# Altium project PreCharge.PrjPcb (part 1 of 2)
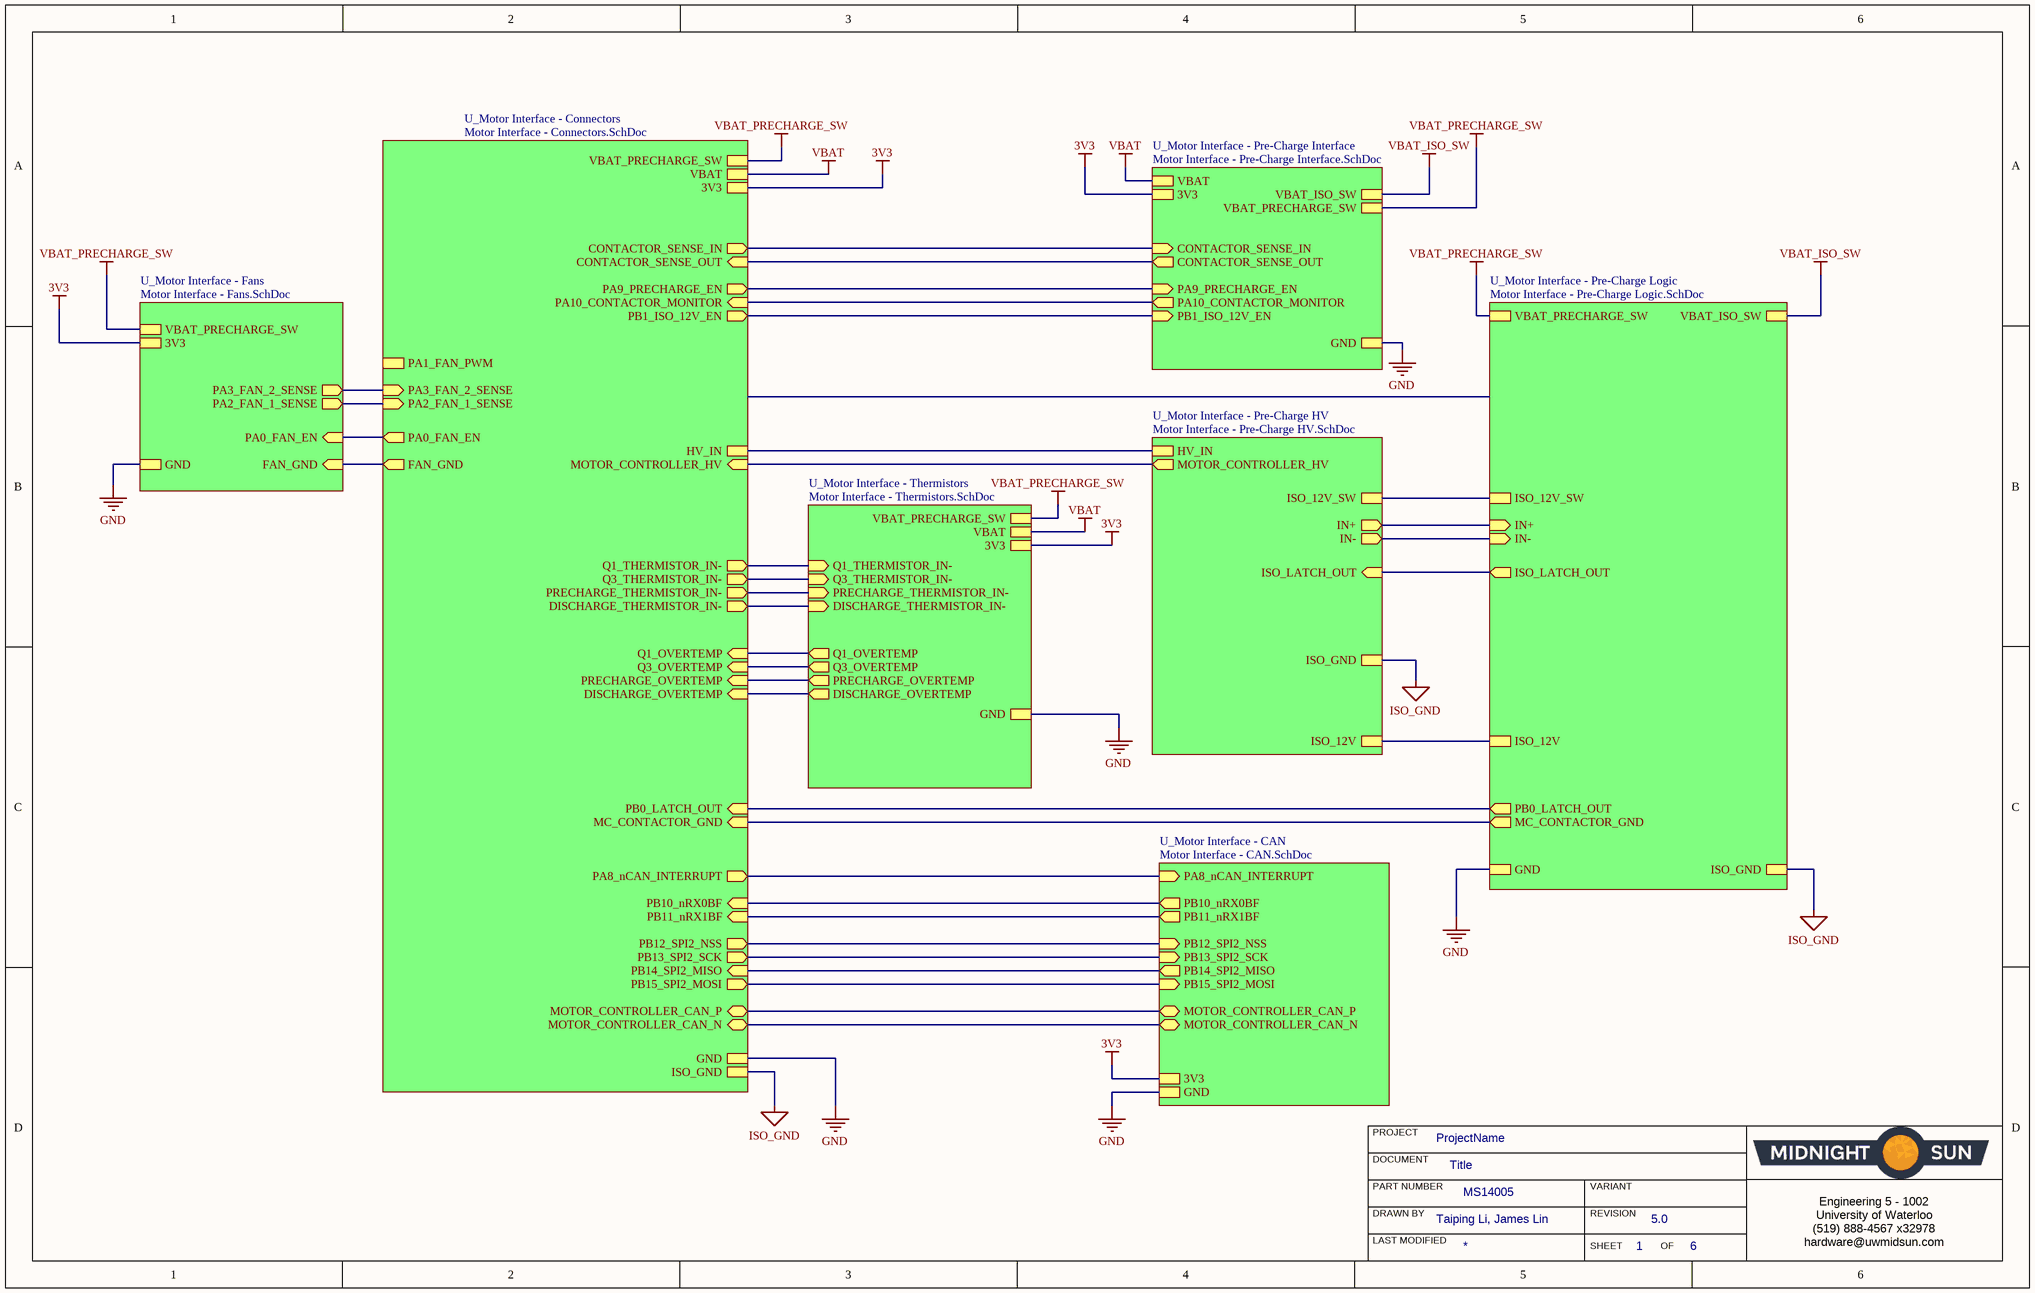
[diagram p0: Motor Interface - Top Sheet.SchDoc]
MSPartNumber: MS14005; ProjectAuthor: Taiping Li, James Lin; ProjectRevision: 5.0
5 sheets, 69 parts. Net scope: strictly hierarchical (ports join the sheet entries above them; power ports are local).
Board file: Motor Interface.PcbDoc
Sheets:
  Motor Interface - Top Sheet.SchDoc
    U_Motor Interface - CAN = Motor Interface - CAN.SchDoc
    U_Motor Interface - Pre-Charge Interface = Motor Interface - Pre-Charge Interface.SchDoc
    U_Motor Interface - Connectors = Motor Interface - Connectors.SchDoc
    U_Motor Interface - Thermistors = Motor Interface - Thermistors.SchDoc

## Sheet Motor Interface - Top Sheet.SchDoc: Title
size B; Organization: Midnight Sun Solar Rayce Car Team; Address1: University of Waterloo; Address2: 200 University Ave W; Address3: Waterloo, ON, Canada; Address4: N2L 3E9; DocumentNumber: 1; SheetNumber: 1; SheetTotal: 6; Website: www.uwmidsun.com; ProjectName: ProjectName

### Sub-sheets
U_Motor Interface - CAN = Motor Interface - CAN.SchDoc: PB12_SPI2_NSS (in), PB14_SPI2_MISO (out), PB15_SPI2_MOSI (in), PB13_SPI2_SCK (in), PA8_nCAN_INTERRUPT (in), MOTOR_CONTROLLER_CAN_P (bidir), MOTOR_CONTROLLER_CAN_N (bidir), PB10_nRX0BF (out), PB11_nRX1BF (out), 3V3, GND
U_Motor Interface - Connectors = Motor Interface - Connectors.SchDoc: MOTOR_CONTROLLER_HV (in), MOTOR_CONTROLLER_CAN_P (bidir), MOTOR_CONTROLLER_CAN_N (bidir), CONTACTOR_SENSE_IN (out), CONTACTOR_SENSE_OUT (in), PB10_nRX0BF (in), PB11_nRX1BF (in), PA10_CONTACTOR_MONITOR (in), PB12_SPI2_NSS (out), PB15_SPI2_MOSI (out), HV_IN, ISO_GND, PA9_PRECHARGE_EN (out), PB13_SPI2_SCK (out), VBAT, PA8_nCAN_INTERRUPT (out), PB14_SPI2_MISO (in), 3V3, GND, VBAT_PRECHARGE_SW, PB0_LATCH_OUT (in), FAN_GND (out), PA0_FAN_EN (out), PA2_FAN_1_SENSE (in), PA3_FAN_2_SENSE (in), Q1_THERMISTOR_IN- (out), Q3_THERMISTOR_IN- (out), PRECHARGE_THERMISTOR_IN- (out), DISCHARGE_THERMISTOR_IN- (out), Q1_OVERTEMP (in), Q3_OVERTEMP (in), PRECHARGE_OVERTEMP (in), DISCHARGE_OVERTEMP (in), MC_CONTACTOR_GND (in), PB1_ISO_12V_EN (out), PA1_FAN_PWM
U_Motor Interface - Fans = Motor Interface - Fans.SchDoc (file not in this document): GND, FAN_GND (in), PA0_FAN_EN (in), PA2_FAN_1_SENSE (out), PA3_FAN_2_SENSE (out), VBAT_PRECHARGE_SW, 3V3
U_Motor Interface - Pre-Charge HV = Motor Interface - Pre-Charge HV.SchDoc (file not in this document): MOTOR_CONTROLLER_HV (out), IN- (out), IN+ (out), ISO_LATCH_OUT (in), ISO_12V_SW, HV_IN, ISO_GND, ISO_12V
U_Motor Interface - Pre-Charge Interface = Motor Interface - Pre-Charge Interface.SchDoc: CONTACTOR_SENSE_IN (in), CONTACTOR_SENSE_OUT (out), PA9_PRECHARGE_EN (in), GND, PA10_CONTACTOR_MONITOR (out), 3V3, VBAT, VBAT_PRECHARGE_SW, VBAT_ISO_SW, PB1_ISO_12V_EN (in)
U_Motor Interface - Pre-Charge Logic = Motor Interface - Pre-Charge Logic.SchDoc (file not in this document): ISO_LATCH_OUT (out), GND, ISO_GND, ISO_12V_SW, IN- (in), IN+ (in), VBAT_PRECHARGE_SW, PB0_LATCH_OUT (out), ISO_12V, MC_CONTACTOR_GND (out), VBAT_ISO_SW
U_Motor Interface - Thermistors = Motor Interface - Thermistors.SchDoc: Q1_THERMISTOR_IN- (in), Q3_THERMISTOR_IN- (in), PRECHARGE_THERMISTOR_IN- (in), DISCHARGE_THERMISTOR_IN- (in), Q1_OVERTEMP (out), Q3_OVERTEMP (out), PRECHARGE_OVERTEMP (out), DISCHARGE_OVERTEMP (out), GND, 3V3, VBAT, VBAT_PRECHARGE_SW

### Nets
3V3: sheet U_Motor Interface - CAN/3V3, sheet U_Motor Interface - Pre-Charge Interface/CONTACTOR_SENSE_OUT, sheet U_Motor Interface - Pre-Charge Interface/3V3, sheet U_Motor Interface - Connectors/CONTACTOR_SENSE_OUT, sheet U_Motor Interface - Connectors/3V3, sheet U_Motor Interface - Fans/3V3, sheet U_Motor Interface - Thermistors/3V3
GND: sheet U_Motor Interface - CAN/GND, sheet U_Motor Interface - Pre-Charge Interface/GND, sheet U_Motor Interface - Connectors/GND, sheet U_Motor Interface - Pre-Charge Logic/GND, sheet U_Motor Interface - Fans/GND, sheet U_Motor Interface - Thermistors/GND
HV_IN: sheet U_Motor Interface - Pre-Charge HV/HV_IN, sheet U_Motor Interface - Connectors/HV_IN
ISO_GND: sheet U_Motor Interface - Pre-Charge HV/ISO_GND, sheet U_Motor Interface - Connectors/ISO_GND, sheet U_Motor Interface - Pre-Charge Logic/ISO_GND
VBAT: sheet U_Motor Interface - Pre-Charge Interface/VBAT, sheet U_Motor Interface - Connectors/VBAT, sheet U_Motor Interface - Thermistors/VBAT
VBAT_ISO_SW: sheet U_Motor Interface - Pre-Charge Interface/VBAT_ISO_SW, sheet U_Motor Interface - Pre-Charge Logic/VBAT_ISO_SW
VBAT_PRECHARGE_SW: sheet U_Motor Interface - Pre-Charge Interface/VBAT_PRECHARGE_SW, sheet U_Motor Interface - Connectors/VBAT_PRECHARGE_SW, sheet U_Motor Interface - Pre-Charge Logic/VBAT_PRECHARGE_SW, sheet U_Motor Interface - Fans/VBAT_PRECHARGE_SW, sheet U_Motor Interface - Thermistors/VBAT_PRECHARGE_SW
CONTACTOR_SENSE_IN: sheet U_Motor Interface - Pre-Charge Interface/CONTACTOR_SENSE_IN, sheet U_Motor Interface - Connectors/CONTACTOR_SENSE_IN
DISCHARGE_OVERTEMP: sheet U_Motor Interface - Connectors/DISCHARGE_OVERTEMP, sheet U_Motor Interface - Thermistors/DISCHARGE_OVERTEMP
DISCHARGE_THERMISTOR_IN-: sheet U_Motor Interface - Connectors/DISCHARGE_THERMISTOR_IN-, sheet U_Motor Interface - Thermistors/DISCHARGE_THERMISTOR_IN-
FAN_GND: sheet U_Motor Interface - Connectors/FAN_GND, sheet U_Motor Interface - Fans/FAN_GND
MOTOR_CONTROLLER_CAN_N: sheet U_Motor Interface - CAN/MOTOR_CONTROLLER_CAN_N, sheet U_Motor Interface - Connectors/MOTOR_CONTROLLER_CAN_N
MOTOR_CONTROLLER_CAN_P: sheet U_Motor Interface - CAN/MOTOR_CONTROLLER_CAN_P, sheet U_Motor Interface - Connectors/MOTOR_CONTROLLER_CAN_P
MOTOR_CONTROLLER_HV: sheet U_Motor Interface - Pre-Charge HV/MOTOR_CONTROLLER_HV, sheet U_Motor Interface - Connectors/MOTOR_CONTROLLER_HV
PA0/AN0: sheet U_Motor Interface - Connectors/PA0_FAN_EN, sheet U_Motor Interface - Fans/PA0_FAN_EN
PA2: sheet U_Motor Interface - Connectors/PA2_FAN_1_SENSE, sheet U_Motor Interface - Fans/PA2_FAN_1_SENSE
PA3: sheet U_Motor Interface - Connectors/PA3_FAN_2_SENSE, sheet U_Motor Interface - Fans/PA3_FAN_2_SENSE
PA8_nCAN_INTERRUPT: sheet U_Motor Interface - CAN/PA8_nCAN_INTERRUPT, sheet U_Motor Interface - Connectors/PA8_nCAN_INTERRUPT
PA9_PRECHARGE_EN: sheet U_Motor Interface - Pre-Charge Interface/PA9_PRECHARGE_EN, sheet U_Motor Interface - Connectors/PA9_PRECHARGE_EN
PA10_CONTACTOR_MONITOR: sheet U_Motor Interface - Pre-Charge Interface/PA10_CONTACTOR_MONITOR, sheet U_Motor Interface - Connectors/PA10_CONTACTOR_MONITOR
PB0: sheet U_Motor Interface - Connectors/PB0_LATCH_OUT, sheet U_Motor Interface - Pre-Charge Logic/PB0_LATCH_OUT
PB1_ISO_12V_EN: sheet U_Motor Interface - Pre-Charge Interface/PB1_ISO_12V_EN, sheet U_Motor Interface - Connectors/PB1_ISO_12V_EN
PB10_nRX0BF: sheet U_Motor Interface - CAN/PB10_nRX0BF, sheet U_Motor Interface - Connectors/PB10_nRX0BF
PB11_nRX1BF: sheet U_Motor Interface - CAN/PB11_nRX1BF, sheet U_Motor Interface - Connectors/PB11_nRX1BF
PB12_SPI2_NSS: sheet U_Motor Interface - CAN/PB12_SPI2_NSS, sheet U_Motor Interface - Connectors/PB12_SPI2_NSS
PB13_SPI2_SCK: sheet U_Motor Interface - CAN/PB13_SPI2_SCK, sheet U_Motor Interface - Connectors/PB13_SPI2_SCK
PB14_SPI2_MISO: sheet U_Motor Interface - CAN/PB14_SPI2_MISO, sheet U_Motor Interface - Connectors/PB14_SPI2_MISO
PB15_SPI2_MOSI: sheet U_Motor Interface - CAN/PB15_SPI2_MOSI, sheet U_Motor Interface - Connectors/PB15_SPI2_MOSI
PRECHARGE_OVERTEMP: sheet U_Motor Interface - Connectors/PRECHARGE_OVERTEMP, sheet U_Motor Interface - Thermistors/PRECHARGE_OVERTEMP
PRECHARGE_THERMISTOR_IN-: sheet U_Motor Interface - Connectors/PRECHARGE_THERMISTOR_IN-, sheet U_Motor Interface - Thermistors/PRECHARGE_THERMISTOR_IN-
Q1_OVERTEMP: sheet U_Motor Interface - Connectors/Q1_OVERTEMP, sheet U_Motor Interface - Thermistors/Q1_OVERTEMP
Q1_THERMISTOR_IN-: sheet U_Motor Interface - Connectors/Q1_THERMISTOR_IN-, sheet U_Motor Interface - Thermistors/Q1_THERMISTOR_IN-
Q3_OVERTEMP: sheet U_Motor Interface - Connectors/Q3_OVERTEMP, sheet U_Motor Interface - Thermistors/Q3_OVERTEMP
Q3_THERMISTOR_IN-: sheet U_Motor Interface - Connectors/Q3_THERMISTOR_IN-, sheet U_Motor Interface - Thermistors/Q3_THERMISTOR_IN-
(unnamed): sheet U_Motor Interface - Pre-Charge HV/IN-, sheet U_Motor Interface - Pre-Charge Logic/IN-
(unnamed): sheet U_Motor Interface - Pre-Charge HV/IN+, sheet U_Motor Interface - Pre-Charge Logic/IN+
(unnamed): sheet U_Motor Interface - Pre-Charge HV/ISO_LATCH_OUT, sheet U_Motor Interface - Pre-Charge Logic/ISO_LATCH_OUT
(unnamed): sheet U_Motor Interface - Pre-Charge HV/ISO_12V_SW, sheet U_Motor Interface - Pre-Charge Logic/ISO_12V_SW
(unnamed): sheet U_Motor Interface - Pre-Charge HV/ISO_12V, sheet U_Motor Interface - Pre-Charge Logic/ISO_12V
(unnamed): sheet U_Motor Interface - Connectors/MC_CONTACTOR_GND, sheet U_Motor Interface - Pre-Charge Logic/MC_CONTACTOR_GND

### Notes on the sheet
- PROJECT
- DOCUMENT
- DRAWN BY
- LAST MODIFIED
- PART NUMBER
- REVISION
- SHEET
- VARIANT
- OF
- Engineering 5 - 1002
  University of Waterloo
  (519) 888-4567 x32978
  hardware@uwmidsun.com

## Sheet Motor Interface - CAN.SchDoc: Motor Interface - CAN
size B; PageSetup: Record=PageOptions|CenterHorizontal=True|CenterVertical=True|PrintScale=0.64|XCorrection=1.00|YCorrection=1.00|PrintKind=1|BorderSize=5000000|LeftOffset=0|BottomOffset=0|Orientation=2|PaperLength=1000|PaperWidth=1000|Scale=100|PaperSource=7|PrintQuality=-3|MediaType=1|DitherType=10|PrintScaleMode=1|PaperKind=Letter|PaperIndex=1; Organization: Midnight Sun Solar Rayce Car Team; Address1: University of Waterloo; Address2: 200 University Ave W; Address3: Waterloo, ON, Canada; Address4: N2L 3E9; DocumentNumber: 3; SheetNumber: 3; SheetTotal: 6; Website: www.uwmidsun.com; ProjectName: ProjectName
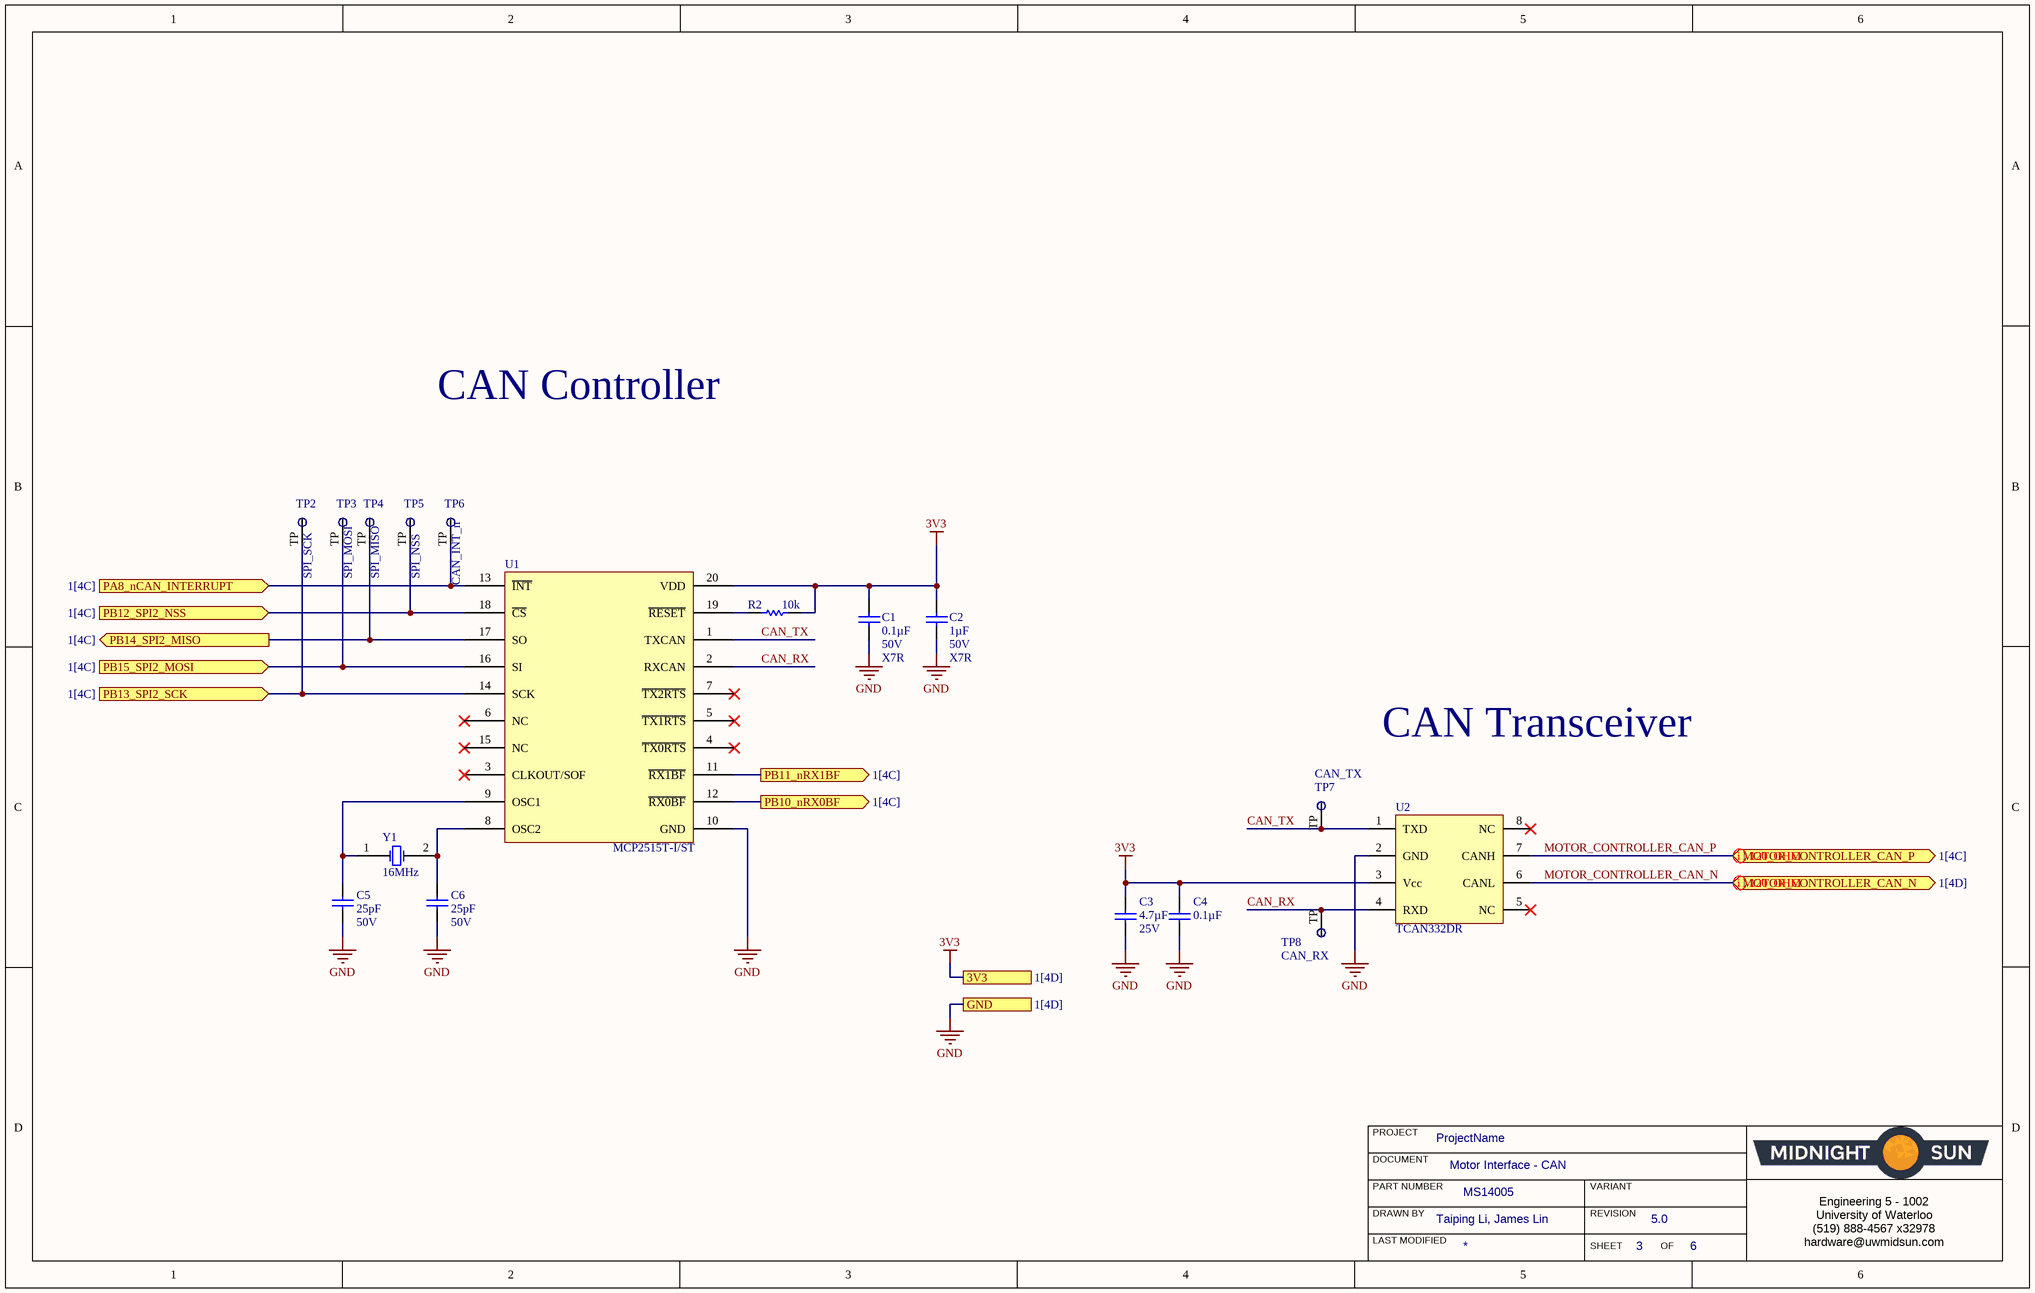
[diagram p1: Motor Interface - CAN.SchDoc]

### Parts
C1  Capacitance: 0.1µF  Voltage: 50V  Temperature Coefficient: X7R  [CAP, 0603]  (hidden comment: CAP CER 0.1UF 50V 10% X7R 0603)
C2  Capacitance: 1µF  Voltage: 50V  Temperature Coefficient: X7R  [CAP, 0603]  (hidden comment: CAP CER 1UF 50V 10% X7R 0603)
C3  Voltage: 25V  Capacitance: 4.7µF  [CAP, 0603]  (hidden comment: CAP CER 4.7UF 25V 10% X5R 0603)
C4  Capacitance: 0.1µF  [CAP, 0603]  (hidden comment: CAP CER 0.1UF 50V 10% X7R 0603)
C5  Voltage - Rated: 50V  Capacitance: 25pF  [CAP, 0603]  (hidden comment: CAP CER 25PF 50V ±5% C0G/NP0 0603)
C6  Voltage - Rated: 50V  Capacitance: 25pF  [CAP, 0603]  (hidden comment: CAP CER 25PF 50V ±5% C0G/NP0 0603)
R2  Resistance: 10k  [RES, 0603]  (hidden comment: RES 10K OHM 1% 1/10W 0603)
TP2  SPI_SCK  [Test Point]  (no BOM)
TP3  SPI_MOSI  [Test Point]  (no BOM)
TP4  SPI_MISO  [Test Point]  (no BOM)
TP5  SPI_NSS  [Test Point]  (no BOM)
TP6  CAN_INT_n  [Test Point]  (no BOM)
TP7  CAN_TX  [Test Point]  (no BOM)
TP8  CAN_RX  [Test Point]  (no BOM)
U1  Manufacturer Part Number: MCP2515T-I/ST  [TSSOP65P640X120-20N]  (hidden comment: MCP2515)
U2  Manufacturer Part Number: TCAN332DR  [TSOP65P280X145-8N]  (hidden comment: IC CAN Tranceiver TCAN332DR)
Y1  Frequency: 16MHz  [ABM3 CRYSTAL]  (hidden comment: CRYSTAL 16 MHz 18PF 2-SMD)

### Ports
3V3 (see 1[4D]), GND (see 1[4D]), MOTOR_CONTROLLER_CAN_N (bidir, see 1[4D]), MOTOR_CONTROLLER_CAN_P (bidir, see 1[4C]), PA8_nCAN_INTERRUPT (in, see 1[4C]), PB10_nRX0BF (out, see 1[4C]), PB11_nRX1BF (out, see 1[4C]), PB12_SPI2_NSS (in, see 1[4C]), PB13_SPI2_SCK (in, see 1[4C]), PB14_SPI2_MISO (out, see 1[4C]), PB15_SPI2_MOSI (in, see 1[4C])

### Nets
3V3: C1.1 C2.1 C3.2 C4.2 R2.2 U1.20(VDD) U2.3(Vcc) ; port 3V3
GND: C1.2 C2.2 C3.1 C4.1 C5.2 C6.2 U1.10(GND) U2.2(GND) ; port GND
CAN_RX: TP8.TP U1.2(RXCAN) U2.4(RXD)
CAN_TX: TP7.TP U1.1(TXCAN) U2.1(TXD)
MOTOR_CONTROLLER_CAN_N: U2.6(CANL) ; port MOTOR_CONTROLLER_CAN_N
MOTOR_CONTROLLER_CAN_P: U2.7(CANH) ; port MOTOR_CONTROLLER_CAN_P
PA8_nCAN_INTERRUPT: TP6.TP U1.13(~{INT}) ; port PA8_nCAN_INTERRUPT
PB10_nRX0BF: U1.12(~{RX0BF}) ; port PB10_nRX0BF
PB11_nRX1BF: U1.11(~{RX1BF}) ; port PB11_nRX1BF
PB12_SPI2_NSS: TP5.TP U1.18(~{CS}) ; port PB12_SPI2_NSS
PB13_SPI2_SCK: TP2.TP U1.14(SCK) ; port PB13_SPI2_SCK
PB14_SPI2_MISO: TP4.TP U1.17(SO) ; port PB14_SPI2_MISO
PB15_SPI2_MOSI: TP3.TP U1.16(SI) ; port PB15_SPI2_MOSI
NetC5_1: C5.1 U1.9(OSC1) Y1.1
NetC6_1: C6.1 U1.8(OSC2) Y1.2
NetR2_1: R2.1 U1.19(~{RE}~{SET})

Not connected (* = marked no-connect by the designer): U1 3(CLKOUT/SOF)* 4(~{TX0RTS})* 5(~{TX1RTS})* 6(NC)* 7(~{TX2RTS})* 15(NC)*; U2 5(NC)* 8(NC)*

### Layout directives
differential pair: MOTOR_CONTROLLER_CAN_N, MOTOR_CONTROLLER_CAN_P

### Notes on the sheet
- CAN Controller
- CAN Transceiver
- PROJECT
- DOCUMENT
- DRAWN BY
- LAST MODIFIED
- PART NUMBER
- REVISION
- SHEET
- VARIANT
- OF
- Engineering 5 - 1002
  University of Waterloo
  (519) 888-4567 x32978
  hardware@uwmidsun.com

### Library data of the parts
C1 C4 = CAP CER 0.1UF 50V 10% X7R 0603: 0.10µF ±10% 50V Ceramic Capacitor X7R 0603 (1608 Metric); Manufacturer 1: AVX Corporation; Manufacturer Part Number 1: 06035C104KAT2A; Supplier 1: Digi-Key; Supplier Part Number 1: 478-5052-1-ND; Packaging: Cut Tape (CT); Part Status: Active; Operating Temperature: -55°C ~ 125°C; Ratings: -; Mounting Type: Surface Mount, MLCC; Package / Case: 0603 (1608 Metric); Size / Dimension: 0.063" L x 0.032" W (1.60mm x 0.81mm); Height - Seated (Max): -; Thickness (Max): 0.035" (0.90mm); Lead Spacing: -; Lead Style: -; ComponentLink1URL: http://datasheets.avx.com/X7RDielectric.pdf; ComponentLink1Description: http://datasheets.avx.com/X7RDielectric.pdf; Tolerance: ±10%
  C4: Voltage: 50V; Temperature Coefficient: X7R
C2 = CAP CER 1UF 50V 10% X7R 0603: 1µF ±10% 50V Ceramic Capacitor X7R 0603 (1608 Metric); Manufacturer 1: Taiyo Yuden; Manufacturer Part Number 1: UMK107AB7105KA-T; Supplier 1: Digi-Key; Supplier Part Number 1: 587-3247-1-ND; Packaging: Cut Tape (CT); Part Status: Active; Operating Temperature: -55°C ~ 125°C; Ratings: -; Mounting Type: Surface Mount, MLCC; Package / Case: 0603 (1608 Metric); Size / Dimension: 0.063" L x 0.031" W (1.60mm x 0.80mm); Height - Seated (Max): -; Thickness (Max): 0.037" (0.95mm); Lead Spacing: -; Lead Style: -; ComponentLink1URL: http://www.yuden.co.jp/productdata/catalog/en/mlcc_all_e.pdf; ComponentLink1Description: http://www.yuden.co.jp/productdata/catalog/en/mlcc_all_e.pdf; Tolerance: ±10%
C3 = CAP CER 4.7UF 25V 10% X5R 0603: 4.7µF ±10% 25V Ceramic Capacitor X5R 0603 (1608 Metric); Manufacturer 1: Murata Electronics North America; Manufacturer Part Number 1: GRM188R61E475KE11D; Supplier 1: Digi-Key; Supplier Part Number 1: 490-7203-1-ND; Packaging: Cut Tape (CT); Part Status: Active; Operating Temperature: -55°C ~ 85°C; Ratings: -; Mounting Type: Surface Mount, MLCC; Package / Case: 0603 (1608 Metric); Size / Dimension: 0.063" L x 0.031" W (1.60mm x 0.80mm); Height - Seated (Max): -; Thickness (Max): 0.031" (0.80mm); Lead Spacing: -; Lead Style: -; ComponentLink1URL: http://www.murata.com/~/media/webrenewal/support/library/catalog/products/capacitor/mlcc/c02e.ashx; ComponentLink1Description: http://www.murata.com/~/media/webrenewal/support/library/catalog/products/capacitor/mlcc/c02e.ashx; Tolerance: ±10%; Temperature Coefficient: X5R
C5 C6 = CAP CER 25PF 50V ±5% C0G/NP0 0603: 25pF 50V Ceramic Capacitor C0G, NP0 0603 (1608 Metric) 0.063" L x 0.032" W (1.60mm x 0.80mm); Manufacturer: Samsung Electro-Mechanics; Manufacturer Part Number: CL10C250JB8NNNC; Notification: Current market demand for these product types have resulted in fluctuating and extending lead times. Lead times may differ.; Supplier 1: Digi-Key; RoHS: RoHS Compliant; Category: Capacitors; Stock 1: 36668; Pricing 1: 1=0.14, 10=0.061, 100=0.0274, 500=0.01962, 1000=0.01542 (CAD); Packaging: Cut Tape (CT); Part Status: Active; Tolerance: ±5%; Operating Temperature: -55°C ~ 125°C; Features: -; Ratings: -; Applications: General Purpose; Mounting Type: Surface Mount, MLCC; Package / Case: 0603 (1608 Metric); Size / Dimension: 0.063" L x 0.032" W (1.60mm x 0.80mm); Height - Seated (Max): -; Thickness (Max): 0.035" (0.90mm); Lead Spacing: -; Lead Style: -; ComponentLink1URL: http://www.samsungsem.com/kr/support/product-search/mlcc/CL10C250JB8NNNC.jsp; ComponentLink1Description: http://www.samsungsem.com/kr/support/product-search/mlcc/CL10C250JB8NNNC.jsp; Supplier Part Number 1: 1276-2244-1-ND; Temperature Coefficient: C0G, NP0
R2 = RES 10K OHM 1% 1/10W 0603: RES SMD 10K OHM 1% 1/10W 0603; Manufacturer 1: Yageo; Manufacturer Part Number 1: RC0603FR-0710KL; Temperature Coefficient: ±100ppm/°C; Supplier 1: Digi-Key; Supplier Part Number 1: 311-10.0KHRCT-ND; Packaging: Cut Tape (CT); Part Status: Active; Composition: Thick Film; Operating Temperature: -55°C ~ 155°C; Package / Case: 0603 (1608 Metric); Supplier Device Package: 0603; Size / Dimension: 0.063" L x 0.031" W (1.60mm x 0.80mm); Height - Seated (Max): 0.022" (0.55mm); Failure Rate: -; ComponentLink1URL: http://www.yageo.com/documents/recent/PYu-RC_Group_51_RoHS_L_7.pdf; ComponentLink1Description: http://www.yageo.com/documents/recent/PYu-RC_Group_51_RoHS_L_7.pdf; Tolerance: ±1%; Power: 1/10W
TP2-TP8 = Test Point
U1 = IC CAN SPI CONTROLLER MCP2515T-I/ST 20-TSSOP: CAN Controller CAN 2.0 SPI Interface 20-TSSOP; Manufacturer: Microchip Technology; Standards: CAN 2.0; Voltage - Supply: 2.7 V ~ 5.5 V; Current - Supply: 10mA; Supplier 1: Digi-Key; RoHS: RoHS Compliant; Category: Integrated Circuits (ICs); Stock 1: 27278; Pricing 1: 1=3.04, 25=2.5372, 100=2.3076 (CAD); Packaging: Cut Tape (CT); Part Status: Active; Protocol: CAN; Function: Controller; Interface: SPI; Operating Temperature: -40°C ~ 85°C; Package / Case: 20-TSSOP (0.173", 4.40mm Width); Supplier Device Package: 20-TSSOP; Base Part Number: MCP2515; ComponentLink1URL: http://www.microchip.com/mymicrochip/filehandler.aspx?ddocname=en011733; ComponentLink1Description: http://www.microchip.com/mymicrochip/filehandler.aspx?ddocname=en011733; Supplier Part Number 1: MCP2515T-I/STCT-ND
U2 = IC CAN Tranceiver TCAN332DR: 1/1 Transceiver CAN 8-SOIC; Supplier 1: Digi-Key; Supplier Part Number 1: 296-43711-1-ND; Digikey Part Number: 296-43711-1-ND
Y1 = CRYSTAL 16 MHz 18PF 2-SMD: 16MHz ±20ppm Crystal 18pF 40 Ohms 2-SMD, No Lead; Manufacturer: Abracon LLC; Manufacturer Part Number: ABM3-16.000MHZ-D2Y-T; Frequency Stability: ±30ppm; Operating Mode: Fundamental; Supplier 1: Digi-Key; RoHS: RoHS Compliant; Category: Crystals, Oscillators, Resonators; Stock 1: 27142; Pricing 1: 1=1.02, 10=0.858, 50=0.7712, 100=0.6855, 500=0.6512 (CAD); Packaging: Cut Tape (CT); Part Status: Active; Type: MHz Crystal; Frequency Tolerance: ±20ppm; Load Capacitance: 18pF; Operating Temperature: -40°C ~ 85°C; Ratings: -; Mounting Type: Surface Mount; Package / Case: 2-SMD, No Lead; Size / Dimension: 0.197" L x 0.126" W (5.00mm x 3.20mm); Height - Seated (Max): 0.051" (1.30mm); ComponentLink1URL: https://abracon.com/Resonators/abm3.pdf; ComponentLink1Description: https://abracon.com/Resonators/abm3.pdf; Supplier Part Number 1: 535-10638-1-ND

## Sheet Motor Interface - Pre-Charge Interface.SchDoc: Motor Interface - PreCharge Interface
size B; Organization: Midnight Sun Solar Rayce Car Team; Address1: University of Waterloo; Address2: 200 University Ave W; Address3: Waterloo, ON, Canada; Address4: N2L 3E9; DocumentNumber: 4; SheetNumber: 4; SheetTotal: 6; Website: www.uwmidsun.com
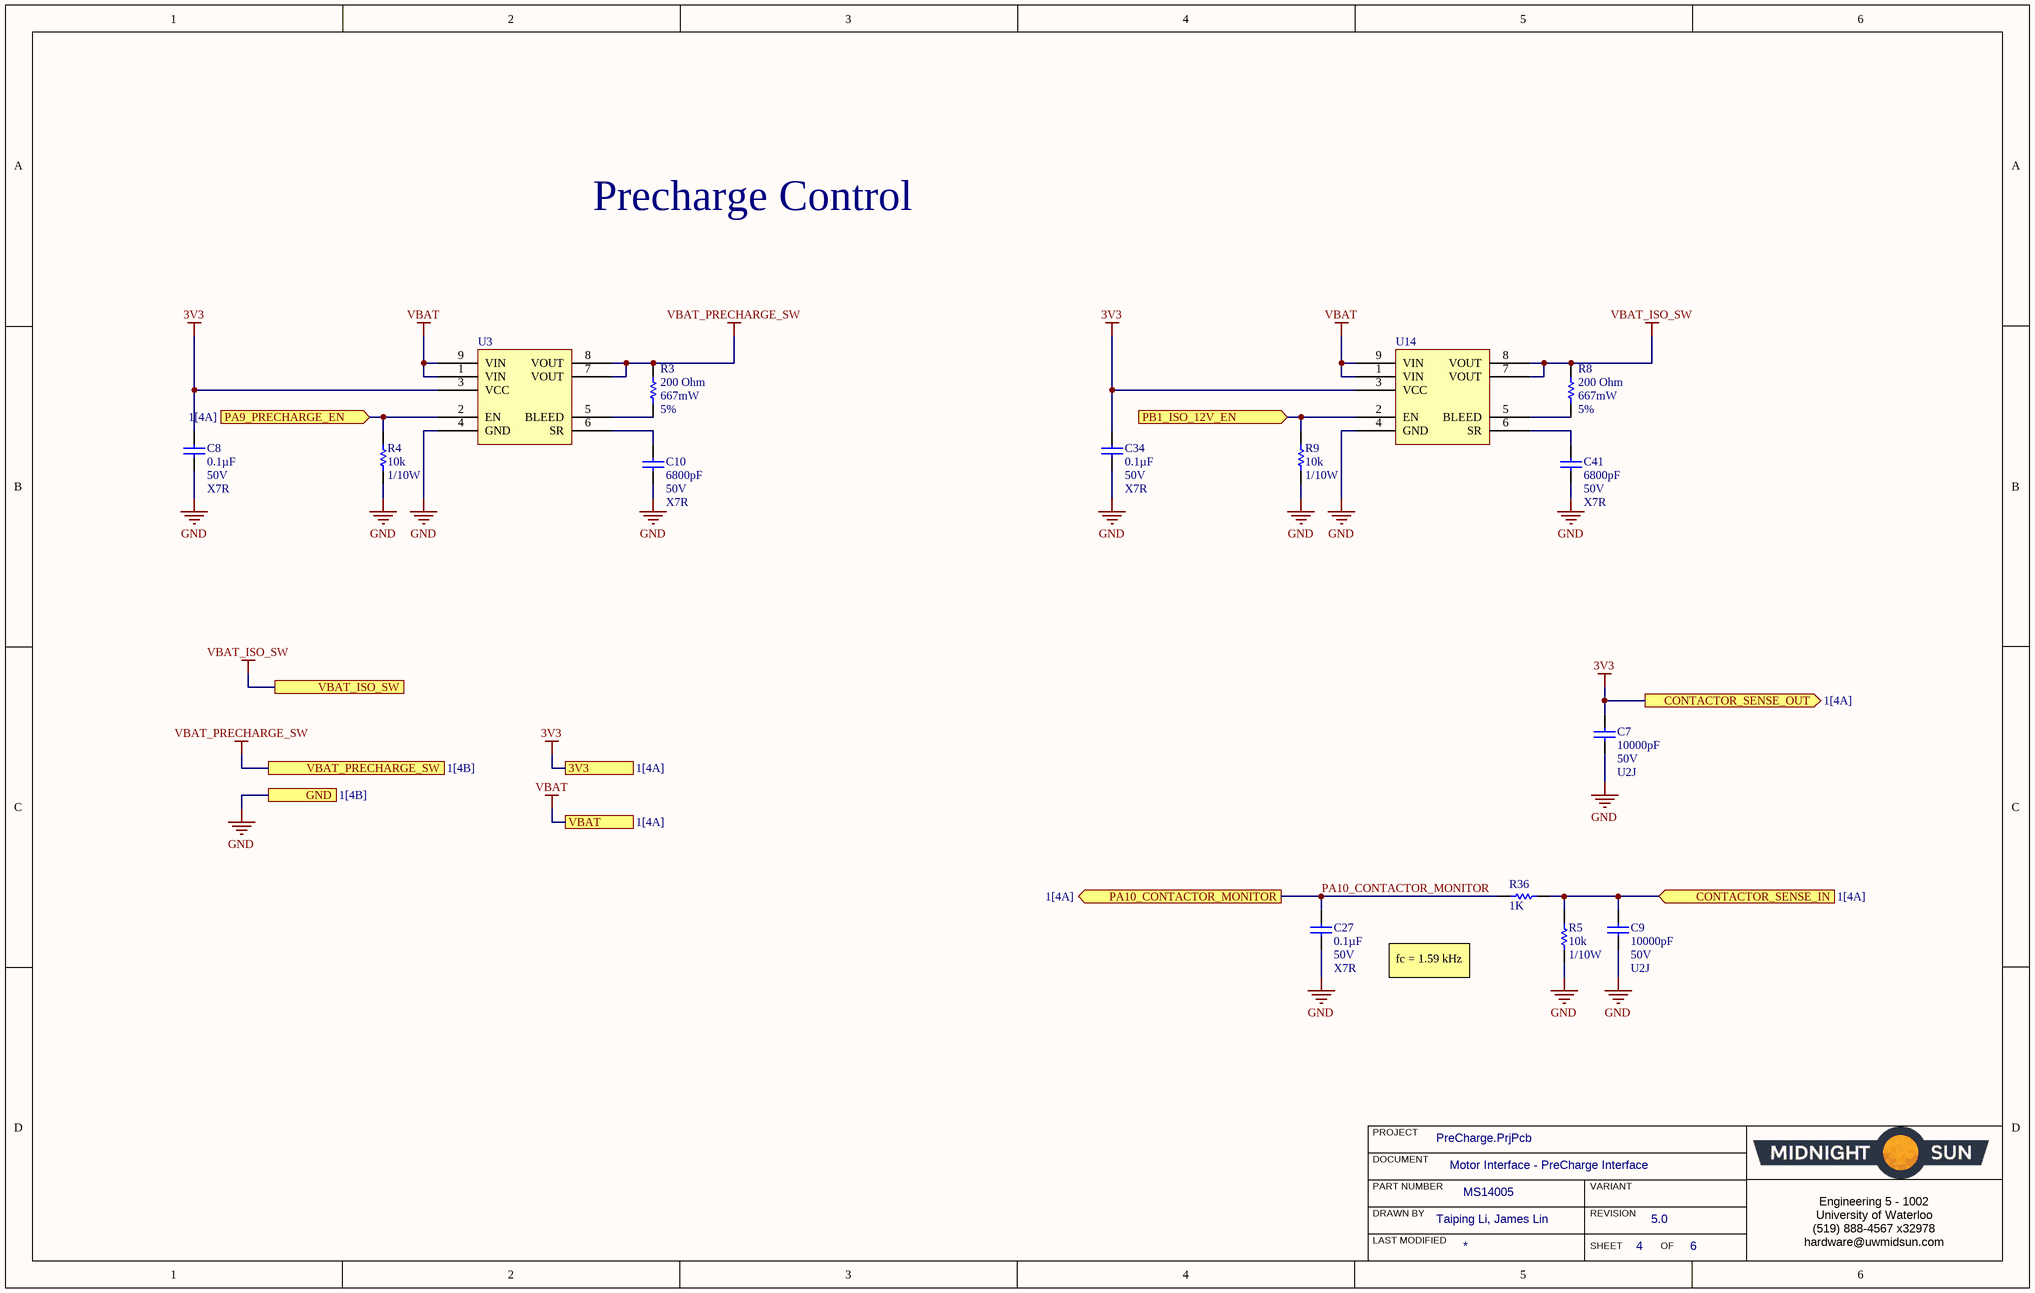
[diagram p2: Motor Interface - Pre-Charge Interface.SchDoc]

### Parts
C7  Capacitance: 10000pF  Voltage: 50V  Temperature Coefficient: U2J  [CAP, 0603]  (hidden comment: CAP CER 10nF 50V 5% X7R 0603)
C8  Capacitance: 0.1µF  Voltage: 50V  Temperature Coefficient: X7R  [CAP, 0603]  (hidden comment: CAP CER 0.1UF 50V 10% X7R 0603)
C9  Capacitance: 10000pF  Voltage: 50V  Temperature Coefficient: U2J  [CAP, 0603]  (hidden comment: CAP CER 10nF 50V 5% X7R 0603)
C10  Capacitance: 6800pF  Voltage: 50V  Temperature Coefficient: X7R  [CAP, 0603]  (hidden comment: CAP CER 6800pF 50V 10% X7R 0603)
C27  Capacitance: 0.1µF  Voltage: 50V  Temperature Coefficient: X7R  [CAP, 0603]  (hidden comment: CAP CER 0.1UF 50V 10% X7R 0603)
C34  Capacitance: 0.1µF  Voltage: 50V  Temperature Coefficient: X7R  [CAP, 0603]  (hidden comment: CAP CER 0.1UF 50V 10% X7R 0603)
C41  Capacitance: 6800pF  Voltage: 50V  Temperature Coefficient: X7R  [CAP, 0603]  (hidden comment: CAP CER 6800pF 50V 10% X7R 0603)
R3  200 Ohm  Tolerance: 5%  Max Power Dissipation: 667mW  [RES 1206]
R4  Resistance: 10k  Power: 1/10W  [RES, 0603]  (hidden comment: RES 10K OHM 1% 1/10W 0603)
R5  Resistance: 10k  Power: 1/10W  [RES, 0603]  (hidden comment: RES 10K OHM 1% 1/10W 0603)
R8  200 Ohm  Tolerance: 5%  Max Power Dissipation: 667mW  [RES 1206]
R9  Resistance: 10k  Power: 1/10W  [RES, 0603]  (hidden comment: RES 10K OHM 1% 1/10W 0603)
R36  1K  [RES, 0603]
U3  IC LOAD SWITCH ACT-HI 10.5A 8DFN  [IC LOAD SWITCH ACT-HI 10.5A 8DFN]  (value not drawn)
U14  IC LOAD SWITCH ACT-HI 10.5A 8DFN  [IC LOAD SWITCH ACT-HI 10.5A 8DFN]  (value not drawn)

### Ports
3V3 (see 1[4A]), CONTACTOR_SENSE_IN (in, see 1[4A]), CONTACTOR_SENSE_OUT (out, see 1[4A]), GND (see 1[4B]), PA9_PRECHARGE_EN (in, see 1[4A]), PA10_CONTACTOR_MONITOR (out, see 1[4A]), PB1_ISO_12V_EN (in), VBAT (see 1[4A]), VBAT_ISO_SW, VBAT_PRECHARGE_SW (see 1[4B])

### Nets
3V3: C7.1 C8.1 C34.1 U3.3(VCC) U14.3(VCC) ; port CONTACTOR_SENSE_OUT, port 3V3
GND: C7.2 C8.2 C9.2 C10.2 C27.2 C34.2 C41.2 R4.2 R5.2 R9.2 U3.4(GND) U14.4(GND) ; port GND
VBAT: U3.1(VIN) U3.9(VIN) U14.1(VIN) U14.9(VIN) ; port VBAT
VBAT_ISO_SW: R8.1 U14.7(VOUT) U14.8(VOUT) ; port VBAT_ISO_SW
VBAT_PRECHARGE_SW: R3.1 U3.7(VOUT) U3.8(VOUT) ; port VBAT_PRECHARGE_SW
CONTACTOR_SENSE_IN: C9.1 R5.1 R36.2 ; port CONTACTOR_SENSE_IN
PA9_PRECHARGE_EN: R4.1 U3.2(EN) ; port PA9_PRECHARGE_EN
PA10_CONTACTOR_MONITOR: C27.1 R36.1 ; port PA10_CONTACTOR_MONITOR
PB1_ISO_12V_EN: R9.1 U14.2(EN) ; port PB1_ISO_12V_EN
NetC10_1: C10.1 U3.6(SR)
NetC41_1: C41.1 U14.6(SR)
NetR3_2: R3.2 U3.5(BLEED)
NetR8_2: R8.2 U14.5(BLEED)

### Notes on the sheet
- Precharge Control
- fc = 1.59 kHz
- PROJECT
- DOCUMENT
- DRAWN BY
- LAST MODIFIED
- PART NUMBER
- REVISION
- SHEET
- VARIANT
- OF
- Engineering 5 - 1002
  University of Waterloo
  (519) 888-4567 x32978
  hardware@uwmidsun.com

### Library data of the parts
C7 C9 = CAP CER 10nF 50V 5% X7R 0603: 10000pF ±5% 50V Ceramic Capacitor U2J 0603 (1608 Metric); Manufacturer 1: KEMET; Manufacturer Part Number 1: C0603C103J5JAC7867; Supplier 1: Digi-Key; Supplier Part Number 1: 399-13384-1-ND; Packaging: Cut Tape (CT); Part Status: Active; Operating Temperature: -55°C ~ 125°C; Ratings: -; Failure Rate: -; Mounting Type: Surface Mount, MLCC; Package / Case: 0603 (1608 Metric); Size / Dimension: 0.063" L x 0.032" W (1.60mm x 0.80mm); Height - Seated (Max): -; Thickness (Max): 0.034" (0.87mm); Lead Spacing: -; Lead Style: -; ComponentLink1URL: http://www.kemet.com/docfinder?Partnumber=C0603C103J5JAC7867; ComponentLink1Description: http://www.kemet.com/docfinder?Partnumber=C0603C103J5JAC7867; Tolerance: ±5%
C8 C27 C34 = CAP CER 0.1UF 50V 10% X7R 0603: as C1 on sheet Motor Interface - CAN; Supplier 1: Digi-Key; Supplier Part Number 1: 478-5052-1-ND; Packaging: Cut Tape (CT); Part Status: Active; Operating Temperature: -55°C ~ 125°C; Ratings: -; Mounting Type: Surface Mount, MLCC; Package / Case: 0603 (1608 Metric); Size / Dimension: 0.063" L x 0.032" W (1.60mm x 0.81mm); Height - Seated (Max): -; Thickness (Max): 0.035" (0.90mm); Lead Spacing: -; Lead Style: -; ComponentLink1URL: http://datasheets.avx.com/X7RDielectric.pdf; ComponentLink1Description: http://datasheets.avx.com/X7RDielectric.pdf; Tolerance: ±10%
C10 C41 = CAP CER 6800pF 50V 10% X7R 0603: 6800pF ±10% 50V Ceramic Capacitor X7R 0603 (1608 Metric); Manufacturer 1: Samsung Electro-Mechanics America, Inc.; Manufacturer Part Number 1: CL10B682KB8SFNC; Supplier 1: Digi-Key; Supplier Part Number 1: 1276-2103-1-ND; Packaging: Cut Tape (CT); Part Status: Active; Operating Temperature: -55°C ~ 125°C; Ratings: -; Mounting Type: Surface Mount, MLCC; Package / Case: 0603 (1608 Metric); Size / Dimension: 0.063" L x 0.031" W (1.60mm x 0.80mm); Height - Seated (Max): -; Thickness (Max): 0.035" (0.90mm); Lead Spacing: -; Lead Style: -; ComponentLink1URL: http://www.samsungsem.com/kr/support/product-search/mlcc/CL10B682KB8SFNC.jsp; ComponentLink1Description: http://www.samsungsem.com/kr/support/product-search/mlcc/CL10B682KB8SFNC.jsp; Tolerance: ±10%
R3 R8 = RES 200 OHM 5% 2/3W 1206: 200 Ohms ±5% 0.667W, 2/3W Chip Resistor 1206 (3216 Metric) Automotive AEC-Q200, Pulse Withstanding Thick Film; Manufacturer: Panasonic; Manufacturer Part Number: ERJ-P08J201V; Voltage Rating: 500V; Resistance: 200R; Power Rating: 660mW; Temperature Coefficient: 200ppm/°C; Voltage Rating (DC): 200V; Supplier 1: Digi-Key; Stock 1: 32165; Pricing 1: 1=0.16, 10=0.137, 100=0.0534, 1000=0.02237, 2500=0.02051 (USD); Mount: Surface Mount; Case/Package: 1206; Case Code (Imperial): 1206; Case Code (Metric): 3216; Contact Plating: Tin; Min Operating Temperature: -55°C; Max Operating Temperature: 155°C; Packaging: Tape and Reel; Package Quantity: 1; Termination: SMD/SMT; Composition: Thick Film; Number of Terminations: 2; Length: 3.2mm; Height: 0.028inch; Width: 1.6mm; Radiation Hardening: No; Lead Free: Contains Lead; ComponentLink1URL: https://datasheet.ciiva.com/17207/aoa0000ce4-17207029.pdf; ComponentLink1Description: https://datasheet.ciiva.com/17207/aoa0000ce4-17207029.pdf; ComponentLink2URL: https://datasheet.ciiva.com/9184/aoa0000ce4-9184599.pdf; ComponentLink2Description: https://datasheet.ciiva.com/9184/aoa0000ce4-9184599.pdf; ComponentLink3URL: https://datasheet.ciiva.com/9184/aoa0000ce4-9184603.pdf; ComponentLink3Description: https://datasheet.ciiva.com/9184/aoa0000ce4-9184603.pdf; ComponentLink4URL: https://datasheet.ciiva.com/30201/aoa0000ce4-30201485.pdf; ComponentLink4Description: https://datasheet.ciiva.com/30201/aoa0000ce4-30201485.pdf; Supplier Part Number 1: P200ALCT-ND
R4 R5 R9 = RES 10K OHM 1% 1/10W 0603: as R2 on sheet Motor Interface - CAN; Supplier 1: Digi-Key; Supplier Part Number 1: 311-10.0KHRCT-ND; Packaging: Cut Tape (CT); Part Status: Active; Composition: Thick Film; Operating Temperature: -55°C ~ 155°C; Package / Case: 0603 (1608 Metric); Supplier Device Package: 0603; Size / Dimension: 0.063" L x 0.031" W (1.60mm x 0.80mm); Height - Seated (Max): 0.022" (0.55mm); Failure Rate: -; ComponentLink1URL: http://www.yageo.com/documents/recent/PYu-RC_Group_51_RoHS_L_7.pdf; ComponentLink1Description: http://www.yageo.com/documents/recent/PYu-RC_Group_51_RoHS_L_7.pdf; Tolerance: ±1%
R36 = RES 1K OHM 5% 1/10W 0603: 1k Ohm ±5% 0.1W, 1/10W Chip Resistor 0603 (1608 Metric); Manufacturer: Yageo; Manufacturer Part Number: RC0603JR-071KL; Temperature Coefficient: ±100ppm/°C; Supplier 1: Digi-Key; Supplier Part Number 1: 311-1.0KGRCT-ND; RoHS: RoHS Compliant; Category: Resistors; Stock 1: 4415240; Pricing 1: 1=0.15, 10=0.017, 100=0.0071, 1000=0.0032, 2500=0.00278 (CAD); Packaging: Cut Tape (CT); Part Status: Active; Resistance (Ohms): 1k; Tolerance: ±5%; Power (Watts): 0.1W, 1/10W; Composition: Thick Film; Features: Moisture Resistant; Operating Temperature: -55°C ~ 155°C; Package / Case: 0603 (1608 Metric); Supplier Device Package: 0603; Size / Dimension: 0.063" L x 0.031" W (1.60mm x 0.80mm); Height - Seated (Max): 0.022" (0.55mm); Failure Rate: -; ComponentLink1URL: http://www.yageo.com/documents/recent/PYu-RC_Group_51_RoHS_L_7.pdf; ComponentLink1Description: http://www.yageo.com/documents/recent/PYu-RC_Group_51_RoHS_L_7.pdf
U3 U14 = IC LOAD SWITCH ACT-HI 10.5A 8DFN: NCP45521IMNTWG-H; Manufacturer: ON Semiconductor; Switch Type: General Purpose; Number of Outputs: 1; Ratio - Input:Output: 1:1; Output Configuration: High Side; Output Type: N-Channel; Interface: On/Off; Voltage - Load: 0.5 V ~ 13.5 V; Voltage - Supply (Vcc/Vdd): 3 V ~ 5.5 V; Rds On (Typ): 12.8 mOhm; Input Type: Non-Inverting; Fault Protection: Over Temperature, UVLO; Manufacturer Part Number: NCP45521IMNTWG-H; RoHS: RoHS Compliant; Category: Integrated Circuits (ICs); Packaging: Digi-Reel®; Part Status: Active; Current - Output (Max): 10.5A; Features: Slew Rate Controlled; Operating Temperature: -40°C ~ 85°C (TA); Package / Case: 8-VFDFN Exposed Pad; Supplier Device Package: 8-DFN (2x2); ComponentLink1URL: http://www.onsemi.com/pub/Collateral/NCP45520-D.PDF; ComponentLink1Description: http://www.onsemi.com/pub/Collateral/NCP45520-D.PDF; Supplier 1: Digi-Key; Stock 1: 2377; Pricing 1: 1=1.57, 10=1.405, 100=1.0957, 500=0.90518, 1000=0.71462 (CAD); Supplier 2: Digi-Key; Stock 2: 2211; Pricing 2: 1=1.53, 10=1.372, 100=1.0702, 500=0.88408, 1000=0.69797 (CAD)

## Sheet Motor Interface - Connectors.SchDoc: Motor Interface - Connectors
size B; Organization: Midnight Sun Solar Rayce Car Team; Address1: University of Waterloo; Address2: 200 University Ave W; Address3: Waterloo, ON, Canada; Address4: N2L 3E9; DocumentNumber: 2; SheetNumber: 2; SheetTotal: 6; Website: www.uwmidsun.com
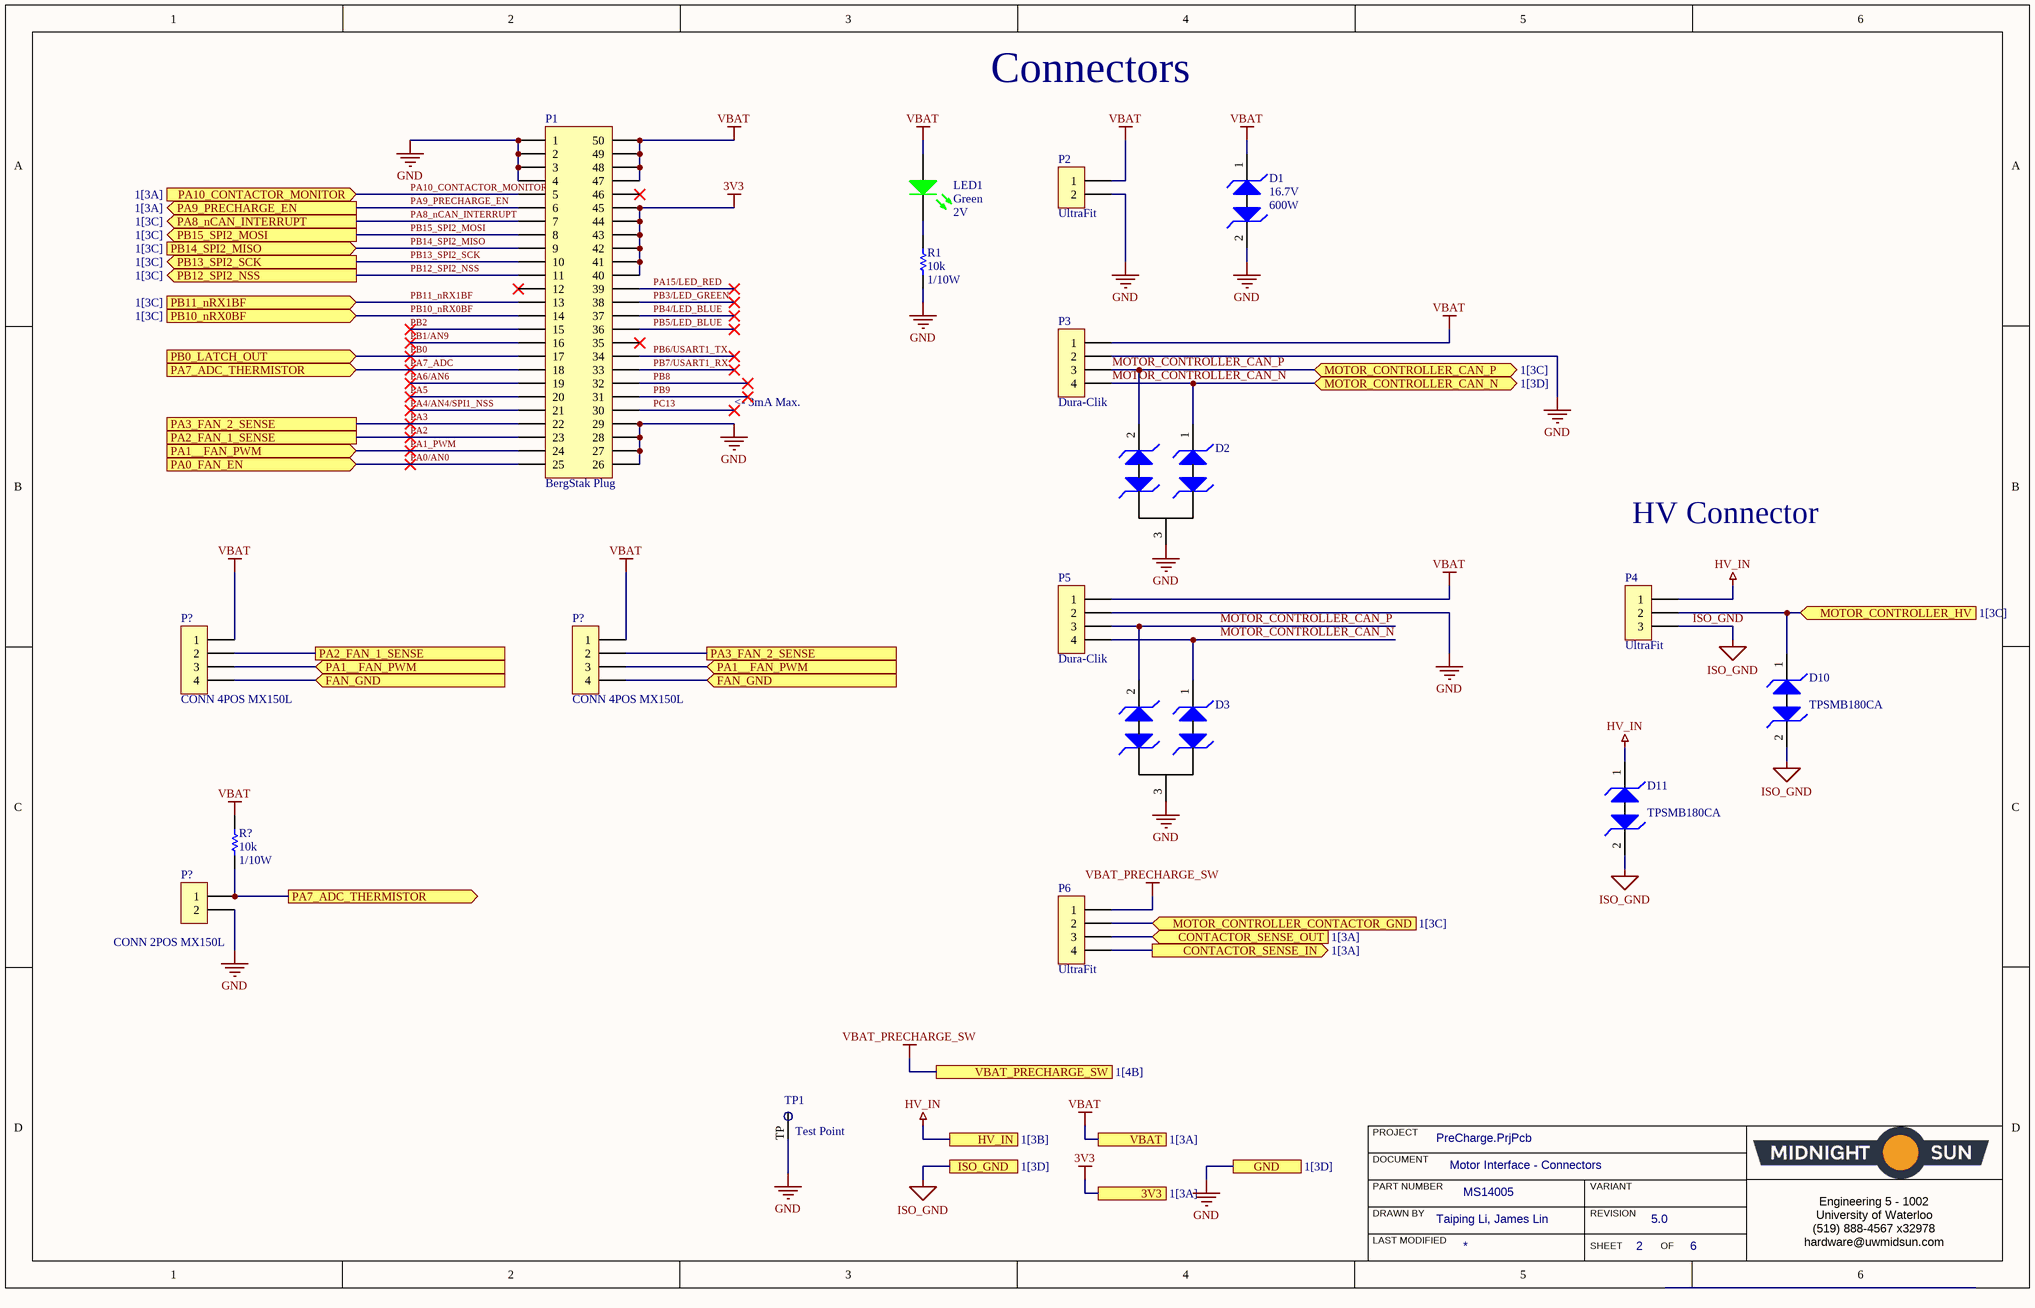
[diagram p3: Motor Interface - Connectors.SchDoc]

### Parts
(Parts that share a designator on the sheet are numbered #1, #2 ... from top to bottom, then left to right.)
D1  Voltage - Breakdown (Min): 16.7V  Power - Peak Pulse: 600W  [DO-214AA Diode]  (hidden comment: DIODE TVS 15VWM 24.4VC DO-214AA (SMB))
D2  DIODE TVS 24VWM 70VC SOT23  [MOSFET P-CH 30V 3.8A SOT-23]  (value not drawn)
D3  DIODE TVS 24VWM 70VC SOT23  [MOSFET P-CH 30V 3.8A SOT-23]  (value not drawn)
D10  Manufacturer Part Number: TPSMB180CA  [DIODE TVS TPSMB 600W DO-214AA SMB]  (hidden comment: TVS DIODE 154V 246V DO214AA)
D11  Manufacturer Part Number: TPSMB180CA  [DIODE TVS TPSMB 600W DO-214AA SMB]  (hidden comment: TVS DIODE 154V 246V DO214AA)
LED1  Color: Green  Voltage - Forward (Vf) (Typ): 2V  [LED_0603]  (hidden comment: LED GREEN CLEAR 2V 0603)
P1  Series: BergStak Plug  [CONN, Bergstak 50 Pos Plug]  (hidden comment: CONN 50POS Bergstak Plug 0.02")
P2  Series: UltraFit  [CONN, 2POS ULTRA-FIT]  (hidden comment: CONN 2POS ULTRA-FIT 0.138")
P3  Dura-Clik  [CONN, 4POS DURA-CLIK VERT]
P4  Series: UltraFit  [CONN, 3POS ULTRA-FIT]  (hidden comment: CONN 3POS ULTRA-FIT 0.138")
P5  Dura-Clik  [CONN, 4POS DURA-CLIK VERT]
P6  Series: UltraFit  [CONN, 4POS ULTRA-FIT]  (hidden comment: CONN 4POS ULTRA-FIT 0.138")
P?#1  CONN 4POS MX150L  [CONN, 4POS MX150L]
P?#2  CONN 4POS MX150L  [CONN, 4POS MX150L]
P?#3  CONN 2POS MX150L  [CONN, 2POS MX150L]
R1  Resistance: 10k  Power: 1/10W  [RES, 0603]  (hidden comment: RES 10K OHM 1% 1/10W 0603)
R?  Resistance: 10k  Power: 1/10W  [RES, 0603]  (hidden comment: RES 10K OHM 1% 1/10W 0603)
TP1  Test Point  [Test Point]

### Ports
3V3 (see 1[3A]), CONTACTOR_SENSE_IN (out, see 1[3A]), CONTACTOR_SENSE_OUT (in, see 1[3A]), FAN_GND (in), GND (see 1[3D]), HV_IN (see 1[3B]), ISO_GND (see 1[3D]), MOTOR_CONTROLLER_CAN_N (bidir, see 1[3D]), MOTOR_CONTROLLER_CAN_P (bidir, see 1[3C]), MOTOR_CONTROLLER_CONTACTOR_GND (in, see 1[3C]), MOTOR_CONTROLLER_HV (in, see 1[3C]), PA0_FAN_EN (in), PA1__FAN_PWM (in), PA2_FAN_1_SENSE, PA3_FAN_2_SENSE, PA7_ADC_THERMISTOR (in), PA7_ADC_THERMISTOR (out), PA8_nCAN_INTERRUPT (out, see 1[3C]), PA9_PRECHARGE_EN (out, see 1[3A]), PA10_CONTACTOR_MONITOR (in, see 1[3A]), PB0_LATCH_OUT (in), PB10_nRX0BF (in, see 1[3C]), PB11_nRX1BF (in, see 1[3C]), PB12_SPI2_NSS (out, see 1[3C]), PB13_SPI2_SCK (out, see 1[3C]), PB14_SPI2_MISO (in, see 1[3C]), PB15_SPI2_MOSI (out, see 1[3C]), VBAT (see 1[3A]), VBAT_PRECHARGE_SW (see 1[4B])

### Nets
3V3: P1.40 P1.41 P1.42 P1.43 P1.44 P1.45 P6.3 ; port CONTACTOR_SENSE_OUT, port 3V3
GND: D1.2(Cathode2) D2.3(Common_Cathode) D3.3(Common_Cathode) P1.1 P1.2 P1.3 P1.4 P1.26 P1.27 P1.28 P1.29 P2.2 P3.2 P5.2 P?#3.2 R1.2 TP1.TP ; port GND
HV_IN: D11.1(Cathode1) P4.1 ; port HV_IN
ISO_GND: D10.2(Cathode2) D11.2(Cathode2) P4.3 ; port ISO_GND
VBAT: D1.1(Cathode1) LED1.1(A) P1.47 P1.48 P1.49 P1.50 P2.1 P3.1 P5.1 P?#1.1 P?#2.1 R?.1 ; port VBAT
VBAT_PRECHARGE_SW: P6.1 ; port VBAT_PRECHARGE_SW
CONTACTOR_SENSE_IN: P6.4 ; port CONTACTOR_SENSE_IN
FAN_GND: P?#1.4 P?#2.4 ; port FAN_GND
MOTOR_CONTROLLER_CAN_N: D2.1(Cathode1) D3.1(Cathode1) P3.4 P5.4 ; port MOTOR_CONTROLLER_CAN_N
MOTOR_CONTROLLER_CAN_P: D2.2(Cathode2) D3.2(Cathode2) P3.3 P5.3 ; port MOTOR_CONTROLLER_CAN_P
MOTOR_CONTROLLER_CONTACTOR_GND: P6.2 ; port MOTOR_CONTROLLER_CONTACTOR_GND
MOTOR_CONTROLLER_HV: D10.1(Cathode1) P4.2 ; port MOTOR_CONTROLLER_HV
PA0/AN0: P1.25 ; port PA0_FAN_EN
PA1_PWM: P1.24 P?#1.3 P?#2.3 ; port PA1__FAN_PWM
PA2: P1.23 P?#1.2 ; port PA2_FAN_1_SENSE
PA3: P1.22 P?#2.2 ; port PA3_FAN_2_SENSE
PA4/AN4/SPI1_NSS: P1.21
PA5: P1.20
PA6/AN6: P1.19
PA7_ADC: P1.18 P?#3.1 R?.2 ; port PA7_ADC_THERMISTOR
PA8_nCAN_INTERRUPT: P1.7 ; port PA8_nCAN_INTERRUPT
PA9_PRECHARGE_EN: P1.6 ; port PA9_PRECHARGE_EN
PA10_CONTACTOR_MONITOR: P1.5 ; port PA10_CONTACTOR_MONITOR
PA15/LED_RED: P1.39
PB0: P1.17 ; port PB0_LATCH_OUT
PB1/AN9: P1.16
PB2: P1.15
PB3/LED_GREEN: P1.38
PB4/LED_BLUE: P1.37
PB5/LED_BLUE: P1.36
PB6/USART1_TX: P1.34
PB7/USART1_RX: P1.33
PB8: P1.32
PB9: P1.31
PB10_nRX0BF: P1.14 ; port PB10_nRX0BF
PB11_nRX1BF: P1.13 ; port PB11_nRX1BF
PB12_SPI2_NSS: P1.11 ; port PB12_SPI2_NSS
PB13_SPI2_SCK: P1.10 ; port PB13_SPI2_SCK
PB14_SPI2_MISO: P1.9 ; port PB14_SPI2_MISO
PB15_SPI2_MOSI: P1.8 ; port PB15_SPI2_MOSI
PC13: P1.30
NetLED1_2: LED1.2(K) R1.1

Not connected (* = marked no-connect by the designer): P1 12* 35* 46*

### Notes on the sheet
- Connectors
- <- 3mA Max.
- HV Connector
- PROJECT
- DOCUMENT
- DRAWN BY
- LAST MODIFIED
- PART NUMBER
- REVISION
- SHEET
- VARIANT
- OF
- Engineering 5 - 1002
  University of Waterloo
  (519) 888-4567 x32978
  hardware@uwmidsun.com

### Library data of the parts
D1 = DIODE TVS 15VWM 24.4VC DO-214AA (SMB): TVS DIODE 15VWM 24.4VC SMB; Manufacturer 1: Fairchild/ON Semiconductor; Manufacturer Part Number 1: SMBJ15CA; Type: Zener; Voltage - Reverse Standoff (Typ): 15V; Voltage - Clamping (Max) @ Ipp: 24.4V; Current - Peak Pulse (10/1000µs): 24.6A; Power Line Protection: No; Supplier 1: Digi-Key; Supplier Part Number 1: SMBJ15CAFSCT-ND; RoHS: RoHS Compliant; Description 1: TVS DIODE 15VWM 24.4VC SMB; Category: Circuit Protection; Stock 1: 24965; Pricing 1: 1=0.54, 10=0.444, 100=0.3027, 500=0.22704, 1000=0.17028 (CAD); Packaging: Cut Tape (CT); Part Status: Active; Applications: General Purpose; Capacitance @ Frequency: -; Operating Temperature: -55°C ~ 150°C (TJ); Mounting Type: Surface Mount; Package / Case: DO-214AA, SMB; Supplier Device Package: DO-214AA (SMB); ComponentLink1URL: https://www.fairchildsemi.com/datasheets/SM/SMBJ10CA.pdf; ComponentLink1Description: https://www.fairchildsemi.com/datasheets/SM/SMBJ10CA.pdf
D2 D3 = DIODE TVS 24VWM 70VC SOT23: TVS DIODE 24VWM 70VC SOT23; Manufacturer 1: Nexperia USA Inc.; Manufacturer Part Number 1: PESD1CAN,215; Type: Zener; Voltage - Breakdown (Min): 25.4V; Voltage - Clamping (Max) @ Ipp: 70V; Current - Peak Pulse (10/1000µs): 3A (8/20µs); Power - Peak Pulse: 200W; Power Line Protection: No; Capacitance @ Frequency: 11pF @ 1MHz; Supplier 1: Digi-Key; Supplier Part Number 1: 1727-3817-1-ND; Packaging: Cut Tape (CT); Part Status: Active; Operating Temperature: -65°C ~ 150°C (TA); Mounting Type: Surface Mount; Package / Case: TO-236-3, SC-59, SOT-23-3; Supplier Device Package: SOT-23 (TO-236AB); ComponentLink1URL: http://assets.nexperia.com/documents/data-sheet/PESD1CAN.pdf; ComponentLink1Description: http://assets.nexperia.com/documents/data-sheet/PESD1CAN.pdf
D10 D11 = DIODE TVS 154V 246V DO-2144A (SMB): Manufacturer: Littelfuse; Supplier 1: Digi-Key; Stock 1: 2900; Pricing 1: 1=0.84, 10=0.734, 25=0.6504, 100=0.5664, 250=0.493, 500=0.41958, 1000=0.33566 (USD); Supplier Part Number 1: F10356CT-ND
LED1 = LED GREEN CLEAR 2V 0603: Green 572nm LED Indication - Discrete 2V 0603 (1608 Metric); Manufacturer: Wurth Electronics Inc.; Manufacturer Part Number: 150060VS75000; Lens Color: Colorless; Millicandela Rating: 40mcd; Lens Style/Size: Rectangle with Flat Top, 1.10mm x 0.70mm; Current - Test: 20mA; Viewing Angle: 140°; Wavelength - Dominant: 570nm; Supplier 1: Digi-Key; RoHS: RoHS Compliant; Category: Optoelectronics; Stock 1: 9408; Pricing 1: 1=0.21, 100=0.1617, 500=0.13964 (CAD); Packaging: Cut Tape (CT); Part Status: Active; Lens Transparency: Clear; Mounting Type: Surface Mount; Wavelength - Peak: 572nm; Features: -; Package / Case: 0603 (1608 Metric); Supplier Device Package: 0603; Size / Dimension: 1.60mm L x 0.80mm W; Height (Max): 0.80mm; ComponentLink1URL: http://katalog.we-online.de/led/datasheet/150060VS75000.pdf; ComponentLink1Description: http://katalog.we-online.de/led/datasheet/150060VS75000.pdf; Supplier Part Number 1: 732-4980-1-ND
P1 = CONN 50POS Bergstak Plug 0.02": 50 Position Connector Plug, Outer Shroud Contacts Surface Mount Gold; Manufacturer 1: Amphenol FCI; Manufacturer Part Number 1: 10132797-055100LF; Number of Positions: 50; Mated Stacking Heights: 5mm; Pitch: 0.020" (0.50mm); Supplier 1: Digi-Key; Supplier Part Number 1: 609-5226-1-ND; Packaging: Cut Tape (CT); Part Status: Active; Connector Type: Plug, Outer Shroud Contacts; Number of Rows: 2; Mounting Type: Surface Mount; Contact Finish: Gold; Contact Finish Thickness: 1µin (0.025µm); Height Above Board: 0.169" (4.30mm); ComponentLink1URL: http://portal.fciconnect.com/Comergent//fci/drawing/10132797.pdf; ComponentLink1Description: http://portal.fciconnect.com/Comergent//fci/drawing/10132797.pdf
P2 = CONN 2POS ULTRA-FIT 0.138": 2 Positions Header, Shrouded Connector 0.138" (3.50mm) Through Hole Gold; Manufacturer 1: Molex, LLC; Manufacturer Part Number 1: 1722861302; Style: Board to Board or Cable; Shrouding: Shrouded - 4 Wall; Number of Positions: 2; Number of Positions Loaded: All; Contact Length - Post: 0.126" (3.20mm); Material Flammability Rating: UL94 V-0; Mated Stacking Heights: 26.99mm; Voltage: 400V; Supplier 1: Digi-Key; Supplier Part Number 1: WM11673-ND; Packaging: Tray; Part Status: Active; Connector Type: Header; Contact Type: Male Pin; Pitch - Mating: 0.138" (3.50mm); Number of Rows: 1; Row Spacing - Mating: -; Mounting Type: Through Hole; Termination: Kinked Pin, Solder; Fastening Type: Latch Holder; Contact Length - Mating: -; Overall Contact Length: -; Insulation Height: 0.465" (11.80mm); Contact Shape: Square; Contact Finish - Mating: Gold; Contact Finish Thickness - Mating: 30µin (0.76µm); Contact Finish - Post: Tin; Contact Material: Copper Alloy; Insulation Material: Liquid Crystal Polymer (LCP); Operating Temperature: -40°C ~ 120°C; Ingress Protection: -; Insulation Color: Black; Current Rating: -; Contact Finish Thickness - Post: 60µin (1.52µm); ComponentLink1URL: http://www.molex.com/pdm_docs/sd/1722861302_sd.pdf; ComponentLink1Description: http://www.molex.com/pdm_docs/sd/1722861302_sd.pdf
P3 P5 = CONN 4POS DURA-CLIK 0.079": 4 Positions Header Connector 0.079" (2.00mm) Surface Mount Tin; Manufacturer: Molex, LLC; Manufacturer Part Number: 5600200420; Style: Board to Cable/Wire; Shrouding: Shrouded - 4 Wall; Number of Positions: 4; Number of Positions Loaded: All; Mated Stacking Heights: 9.3mm; Supplier 1: Digi-Key; RoHS: RoHS Compliant; Category: Connectors, Interconnects; Stock 1: 9367; Pricing 1: 1=2.23, 10=2.022, 25=1.898, 50=1.8156, 100=1.733 (CAD); Packaging: Cut Tape (CT); Part Status: Active; Connector Type: Header; Contact Type: Male Pin; Pitch - Mating: 0.079" (2.00mm); Number of Rows: 1; Row Spacing - Mating: -; Mounting Type: Surface Mount; Termination: Solder; Fastening Type: Latch Lock; Contact Length - Mating: -; Contact Length - Post: -; Overall Contact Length: -; Insulation Height: 0.315" (8.00mm); Contact Shape: Square; Contact Finish - Mating: Tin; Contact Finish Thickness - Mating: -; Contact Finish - Post: Tin; Contact Material: Copper Alloy; Insulation Material: Polyamide (PA), Nylon; Features: Solder Retention; Operating Temperature: -; Ingress Protection: -; Material Flammability Rating: -; Insulation Color: Natural; Current Rating: -; Voltage Rating: -; Contact Finish Thickness - Post: -; Applications: Automotive, Industrial; ComponentLink1URL: http://www.molex.com/pdm_docs/sd/5600200420_sd.pdf; ComponentLink1Description: http://www.molex.com/pdm_docs/sd/5600200420_sd.pdf; Supplier Part Number 1: WM10864CT-ND
P4 = CONN 3POS ULTRA-FIT 0.138": 3 Positions Header Connector 0.138" (3.50mm) Through Hole Tin; Manufacturer 1: Molex, LLC; Manufacturer Part Number 1: 1722871103; Style: Board to Cable/Wire; Shrouding: Shrouded - 4 Wall; Number of Positions: 3; Number of Positions Loaded: All; Contact Length - Post: 0.126" (3.20mm); Material Flammability Rating: UL94 V-0; Mated Stacking Heights: 26.99mm; Voltage: 400V; Supplier 1: Digi-Key; Supplier Part Number 1: WM11702-ND; Packaging: Tray; Part Status: Active; Connector Type: Header; Contact Type: Male Pin; Pitch - Mating: 0.138" (3.50mm); Number of Rows: 1; Row Spacing - Mating: -; Mounting Type: Through Hole; Termination: Solder; Fastening Type: Latch Holder; Contact Length - Mating: -; Overall Contact Length: -; Insulation Height: 0.465" (11.80mm); Contact Shape: Square; Contact Finish - Mating: Tin; Contact Finish Thickness - Mating: 60µin (1.52µm); Contact Finish - Post: Tin; Contact Material: Copper Alloy; Insulation Material: Liquid Crystal Polymer (LCP); Operating Temperature: -40°C ~ 105°C; Ingress Protection: -; Insulation Color: Black; Current Rating: -; Contact Finish Thickness - Post: 60µin (1.52µm); ComponentLink1URL: http://www.molex.com/pdm_docs/sd/1722871103_sd.pdf; ComponentLink1Description: http://www.molex.com/pdm_docs/sd/1722871103_sd.pdf
P6 = CONN 4POS ULTRA-FIT 0.138": 4 Positions Header Connector 0.138" (3.50mm) Through Hole Tin; Manufacturer 1: Molex, LLC; Manufacturer Part Number 1: 1722871104; Style: Board to Cable/Wire; Shrouding: Shrouded - 4 Wall; Number of Positions: 4; Number of Positions Loaded: All; Contact Length - Post: 0.126" (3.20mm); Material Flammability Rating: UL94 V-0; Mated Stacking Heights: 26.99mm; Voltage: 400V; Supplier 1: Digi-Key; Supplier Part Number 1: WM11703-ND; Packaging: Tray; Part Status: Active; Connector Type: Header; Contact Type: Male Pin; Pitch - Mating: 0.138" (3.50mm); Number of Rows: 1; Row Spacing - Mating: -; Mounting Type: Through Hole; Termination: Solder; Fastening Type: Latch Holder; Contact Length - Mating: -; Overall Contact Length: -; Insulation Height: 0.465" (11.80mm); Contact Shape: Square; Contact Finish - Mating: Tin; Contact Finish Thickness - Mating: 60µin (1.52µm); Contact Finish - Post: Tin; Contact Material: Copper Alloy; Insulation Material: Liquid Crystal Polymer (LCP); Operating Temperature: -40°C ~ 105°C; Ingress Protection: -; Insulation Color: Black; Current Rating: -; Contact Finish Thickness - Post: 60µin (1.52µm); ComponentLink1URL: http://www.molex.com/pdm_docs/sd/1722871104_sd.pdf; ComponentLink1Description: http://www.molex.com/pdm_docs/sd/1722871104_sd.pdf
P?#1 P?#2 = CONN 4POS MX150L: Connector Header Panel Mount, Through Hole, Right Angle 4 position 0.230" (5.84mm)
P?#3 = CONN 2POS MX150L: Connector Header Panel Mount, Through Hole, Right Angle 2 position 0.230" (5.84mm); Manufacturer: Molex, LLC; Manufacturer Part Number: 0194270109; Number of Positions: 2; Number of Positions Loaded: All; Style: Board to Cable/Wire; Shrouding: Shrouded - 4 Wall; Contact Length - Post: 0.134" (3.40mm); Material Flammability Rating: UL94 V-0; Supplier 1: Digi-Key; RoHS: RoHS Compliant; Category: Connectors, Interconnects; Stock 1: 0; Pricing 1: 1040=3.59614 (CAD); Packaging: Tray; Part Status: Active; Connector Type: Header; Contact Type: Male Pin; Pitch - Mating: 0.230" (5.84mm); Number of Rows: 1; Row Spacing - Mating: -; Mounting Type: Panel Mount, Through Hole, Right Angle; Termination: Solder; Fastening Type: Locking Ramp; Contact Length - Mating: -; Overall Contact Length: -; Insulation Height: 1.147" (29.13mm); Contact Shape: Square; Contact Finish - Mating: Gold; Contact Finish Thickness - Mating: 30.0µin (0.76µm); Contact Finish - Post: Tin; Contact Material: Copper Alloy; Insulation Material: Polybutylene Terephthalate (PBT), Glass Filled; Features: Board Guide; Operating Temperature: -; Ingress Protection: -; Insulation Color: Black; Current Rating: -; Voltage Rating: -; Mated Stacking Heights: -; Contact Finish Thickness - Post: 100.0µin (2.54µm); Applications: Automotive, General Purpose, Industrial; ComponentLink1URL: https://www.molex.com/pdm_docs/sd/194270109_sd.pdf; ComponentLink1Description: https://www.molex.com/pdm_docs/sd/194270109_sd.pdf; Supplier Part Number 1: 0194270109-ND
R1 R? = RES 10K OHM 1% 1/10W 0603: as R2 on sheet Motor Interface - CAN; Supplier 1: Digi-Key; Supplier Part Number 1: 311-10.0KHRCT-ND; Packaging: Cut Tape (CT); Part Status: Active; Composition: Thick Film; Operating Temperature: -55°C ~ 155°C; Package / Case: 0603 (1608 Metric); Supplier Device Package: 0603; Size / Dimension: 0.063" L x 0.031" W (1.60mm x 0.80mm); Height - Seated (Max): 0.022" (0.55mm); Failure Rate: -; ComponentLink1URL: http://www.yageo.com/documents/recent/PYu-RC_Group_51_RoHS_L_7.pdf; ComponentLink1Description: http://www.yageo.com/documents/recent/PYu-RC_Group_51_RoHS_L_7.pdf; Tolerance: ±1%